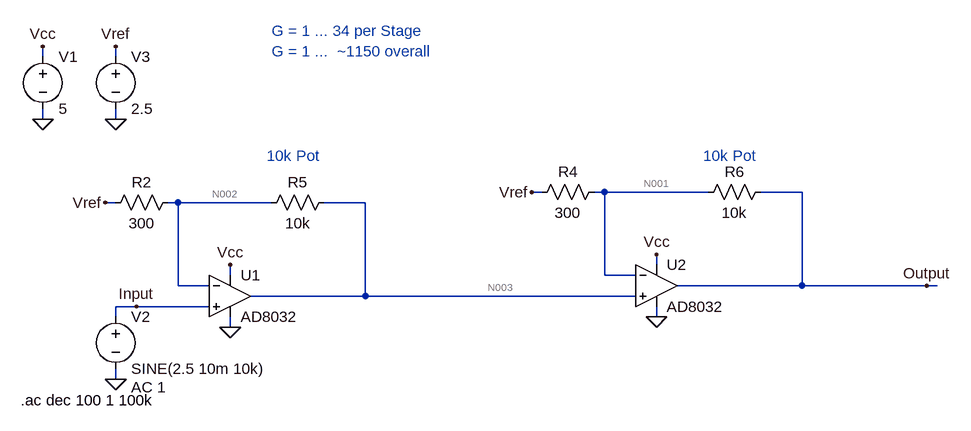
[diagram p0: schematic VGA_Potentiometer.asc]
VGA_Potentiometer.asc, the LTspice schematic file:
Version 4
SHEET 1 1208 680
WIRE -208 -48 -208 -64
WIRE -96 -48 -96 -64
WIRE -208 48 -208 32
WIRE -96 48 -96 32
WIRE 560 160 544 160
WIRE 656 160 640 160
WIRE 816 160 656 160
WIRE 960 160 896 160
WIRE -96 176 -112 176
WIRE 0 176 -16 176
WIRE 144 176 0 176
WIRE 288 176 224 176
WIRE 736 272 736 256
WIRE 80 288 80 272
WIRE 656 288 656 160
WIRE 704 288 656 288
WIRE 0 304 0 176
WIRE 48 304 0 304
WIRE 960 304 960 160
WIRE 960 304 768 304
WIRE 1152 304 960 304
WIRE 1168 304 1152 304
WIRE 288 320 288 176
WIRE 288 320 112 320
WIRE 704 320 288 320
WIRE -64 336 -96 336
WIRE 48 336 -64 336
WIRE -96 352 -96 336
WIRE 736 352 736 336
WIRE 80 368 80 352
WIRE -96 448 -96 432
FLAG -208 48 0
FLAG -208 -64 Vcc
FLAG 80 368 0
FLAG 80 272 Vcc
FLAG -96 448 0
FLAG -96 48 0
FLAG -96 -64 Vref
FLAG -112 176 Vref
FLAG -64 336 Input
FLAG 736 352 0
FLAG 736 256 Vcc
FLAG 544 160 Vref
FLAG 1152 304 Output
SYMBOL voltage -208 -64 R0
WINDOW 123 0 0 Left 0
WINDOW 39 0 0 Left 0
SYMATTR InstName V1
SYMATTR Value 5
SYMBOL OpAmps\\AD8032 80 256 R0
SYMATTR InstName U1
SYMBOL voltage -96 336 R0
WINDOW 123 24 124 Left 2
WINDOW 39 0 0 Left 0
SYMATTR InstName V2
SYMATTR Value SINE(2.5 10m 10k)
SYMATTR Value2 AC 1
SYMBOL res 0 160 R90
WINDOW 0 0 56 VBottom 2
WINDOW 3 32 56 VTop 2
SYMATTR InstName R2
SYMATTR Value 300
SYMBOL voltage -96 -64 R0
WINDOW 123 0 0 Left 0
WINDOW 39 0 0 Left 0
SYMATTR InstName V3
SYMATTR Value 2.5
SYMBOL OpAmps\\AD8032 736 240 R0
SYMATTR InstName U2
SYMBOL res 656 144 R90
WINDOW 0 0 56 VBottom 2
WINDOW 3 32 56 VTop 2
SYMATTR InstName R4
SYMATTR Value 300
SYMBOL res 240 160 R90
WINDOW 0 0 56 VBottom 2
WINDOW 3 32 56 VTop 2
SYMATTR InstName R5
SYMATTR Value 10k
SYMBOL res 912 144 R90
WINDOW 0 0 56 VBottom 2
WINDOW 3 32 56 VTop 2
SYMATTR InstName R6
SYMATTR Value 10k
TEXT -242 480 Left 2 !.ac dec 100 1 100k
TEXT 136 104 Left 2 ;10k Pot
TEXT 808 104 Left 2 ;10k Pot
TEXT 144 -88 Left 2 ;G = 1 ... 34 per Stage\nG = 1 ...  ~1150 overall

The netlist it stands for:
* VGA_Potentiometer.asc
V1 Vcc 0 5
XU1 Input N002 Vcc 0 N003 AD8032  ; pins In+ In- V+ V- OUT
V2 Input 0 SINE(2.5 10m 10k) AC 1
R2 N002 Vref 300
V3 Vref 0 2.5
XU2 N003 N001 Vcc 0 Output AD8032  ; pins In+ In- V+ V- OUT
R4 N001 Vref 300
R5 N003 N002 10k
R6 Output N001 10k
.ac dec 100 1 100k
* 10k Pot
* 10k Pot
* G = 1 ... 34 per Stage
* G = 1 ...  ~1150 overall
.backanno
.end

* Results of the author's LTspice run, read from the files saved beside the schematic
* Operating Point, zero values left out:
*   V(vcc) = 5 V
*   V(n002) = 2.5 V
*   V(input) = 2.5 V
*   V(n003) = 2.496 V
*   V(vref) = 2.5 V
*   V(n001) = 2.496 V
*   V(output) = 2.341 V
*   I(R2) = 330 pA
*   I(R4) = -14.98 µA
*   I(R5) = -449.7 nA
*   I(R6) = -15.43 µA
*   I(V1) = -2.098 mA
*   I(V2) = 450 nA
*   I(V3) = -14.98 µA
*   Ix(u1:1) = -450 nA
*   Ix(u1:2) = -450 nA
*   Ix(u1:3) = 1.042 mA
*   Ix(u1:4) = -1.042 mA
*   Ix(u1:5) = 899.7 nA
*   Ix(u2:1) = -450.1 nA
*   Ix(u2:2) = -450 nA
*   Ix(u2:3) = 1.057 mA
*   Ix(u2:4) = -1.071 mA
*   Ix(u2:5) = 15.43 µA
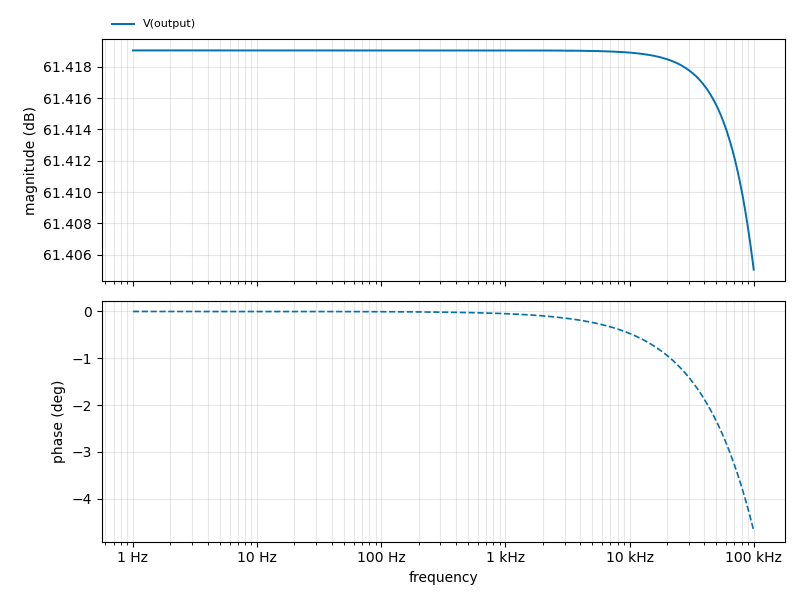
[diagram p1: AC Analysis of VGA_Potentiometer.asc, plotted from the saved traces]
* AC Analysis, 1 run:
*   V(output): 61.42 dB at 1 Hz, 61.41 dB at 100 kHz, peak 61.42 dB at 1.047 Hz